# Altium project main.PrjPcb
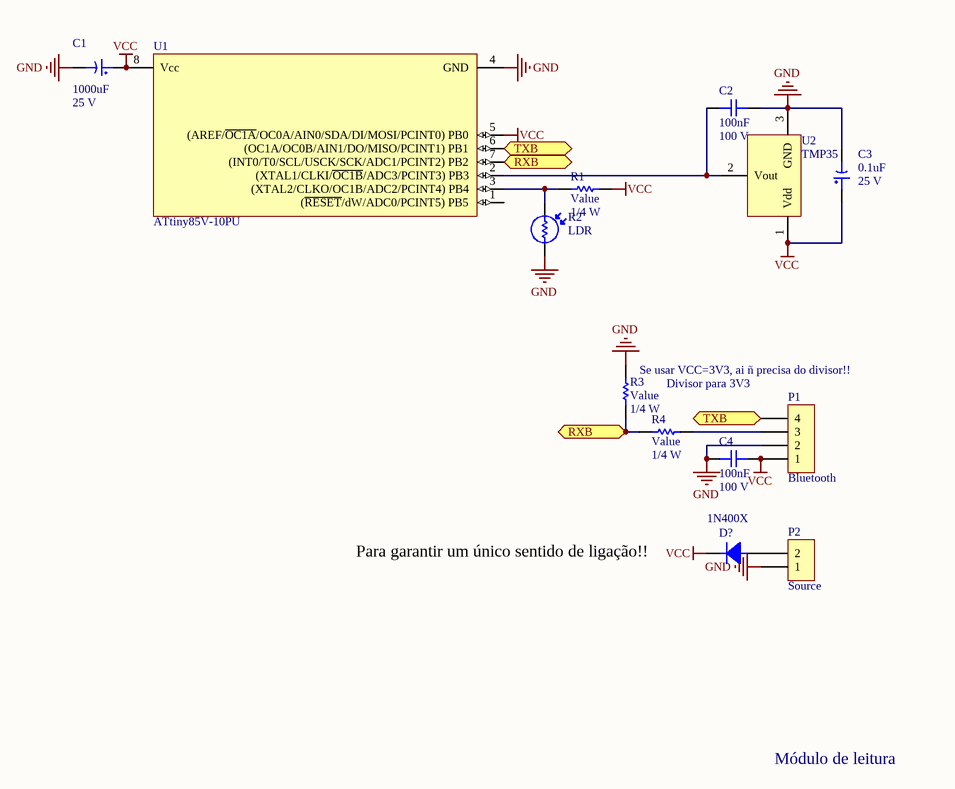
[diagram p0: esquematico.SchDoc]
1 sheet, 13 parts. Net scope: flat (ports and power ports of the same name join across sheets).
Board file: PCB.PcbDoc

## Sheet esquematico.SchDoc
size A4; Author: Natan Ogliari; CompanyName: IFSC; PageSetup: Record=PageOptions|CenterHorizontal=True|CenterVertical=True|PrintScale=0.73|XCorrection=1.00|YCorrection=1.00|PrintKind=1|BorderSize=5000000|LeftOffset=0|BottomOffset=0|Orientation=1|PaperLength=2794|PaperWidth=2159|Scale=100|PaperSource=7|PrintQuality=600|MediaType=1|DitherType=10|PrintScaleMode=1|PaperKind=Letter|PaperIndex=119

### Parts
C1  1000uF  Voltage: 25 V  [CP-RAD-5.0mm-11.0mm-2.0mm]
C2  100nF  Voltage: 100 V  [C100-200-100]
C3  0.1uF  Voltage: 25 V  [CP-RAD-5.0mm-11.0mm-2.0mm]
C4  100nF  Voltage: 100 V  [C100-200-100]
D?  1N400X  [DO-41-Plastic]
P1  Bluetooth  [HDR-M-1x4-2.54mm-180-21.1mm]
P2  Source  [HDR-M-1x2-2.54mm-180-9.2mm]
R1  Value  Power: 1/4 W  [R400-2.0mm]
R2  LDR  [LDR-5mm]
R3  Value  Power: 1/4 W  [R400-2.0mm]
R4  Value  Power: 1/4 W  [R400-2.0mm]
U1  ATtiny85V-10PU  [DIP08-300(100)]
U2  TMP35  [TO-92/123]

### Ports
RXB, TXB

### Nets
GND: C1.2 C2.2 C3.2 C4.1 P1.2 P2.1 R2.2 R3.2 U1.4(GND) U2.3(GND)
VCC: C1.1 C3.1 C4.2 D?.K P1.1 R1.2 U1.5((AREF/~{OC1A}/OC0A/AIN0/SDA/DI/MOSI/PCINT0)_PB0) U1.8(Vcc) U2.1(Vdd)
NetC2_1: C2.1 U1.2((XTAL1/CLKI/~{OC1B}/ADC3/PCINT3)_PB3) U2.2(Vout)
NetD?_A: D?.A P2.2
NetP1_3: P1.3 R4.2
NetP1_4: P1.4 U1.6((OC1A/OC0B/AIN1/DO/MISO/PCINT1)_PB1) ; port TXB
NetR1_1: R1.1 R2.1 U1.3((XTAL2/CLKO/OC1B/ADC2/PCINT4)_PB4)
NetR3_1: R3.1 R4.1 U1.7((INT0/T0/SCL/USCK/SCK/ADC1/PCINT2)_PB2) ; port RXB

Not connected (* = marked no-connect by the designer): U1 1((~{RESET}/dW/ADC0/PCINT5)_PB5)

### Notes on the sheet
- (near R3) Se usar VCC=3V3, ai ñ precisa do divisor!!
- Divisor para 3V3
- Para garantir um único sentido de ligação!!
- Módulo de leitura

### Library data of the parts
C1 C3 = Capacitor-Electrolytic: Electrolytic Capacitor
C2 C4 = Capacitor: Published: 8-Jun-2000; LatestRevisionDate: 17-Jul-2002; LatestRevisionNote: Re-released for DXP Platform.; PackageReference: RAD-0.3; Publisher: Altium Limited
D? = 1N4007: General Purpose Rectifier; Peak Repetitive Reverse Voltage (Vrrm): 1000 V; Forward Current (If): 1 A; Non-Repetitive Peak Forward Surge Current (Ifsm): 30 A; Forward Voltage (Vf): 1.1 V; Reverse Current (Ir): 5 uA; Total Capacitance (Ct): 15 pF
P1 = Header_1x4: Header, 1 Line, 4 Columns, 4 Pins; LatestRevisionDate: 17-Jul-2002; LatestRevisionNote: Re-released for DXP Platform.; Publisher: Altium Limited
P2 = Header_1x2: Header, 1 Line, 2 Columns, 2 Pins; LatestRevisionDate: 17-Jul-2002; LatestRevisionNote: Re-released for DXP Platform.; Publisher: Altium Limited
R1 R3 R4 = Resistor: Tolerance: 5%; Published: 8-Jun-2000; LatestRevisionDate: 17-Jul-2002; LatestRevisionNote: Re-released for DXP Platform.; PackageReference: AXIAL-0.3; Publisher: Altium Limited
R2 = LDR: Ligh Dependant Resistor
U1 = ATtiny85V-10PU: Atmel 8-bit AVR Microcontroller with 8 KB In-System Programmable Flash; ADC Channel: 4; Clock Frequency: 0 - 10 MHz; Debug: debugWire; EEPROM Memory: 512 B; Flash Memory: 8 KB; I/O Pins: 6; PWM Channel: 2; Serial USI: 1; Supply Voltage (Vdd): 1.8 - 5.5 V; Analog Comparator: *; SRAM Memory: 512 B; Timer 8 bits: 1
U2 = LM35: Precise Centigrade Temperature Sensor; Supply Voltage (Vdd): 4 - 30 V